# EAGLE design ink_driver (EAGLE 6.4)
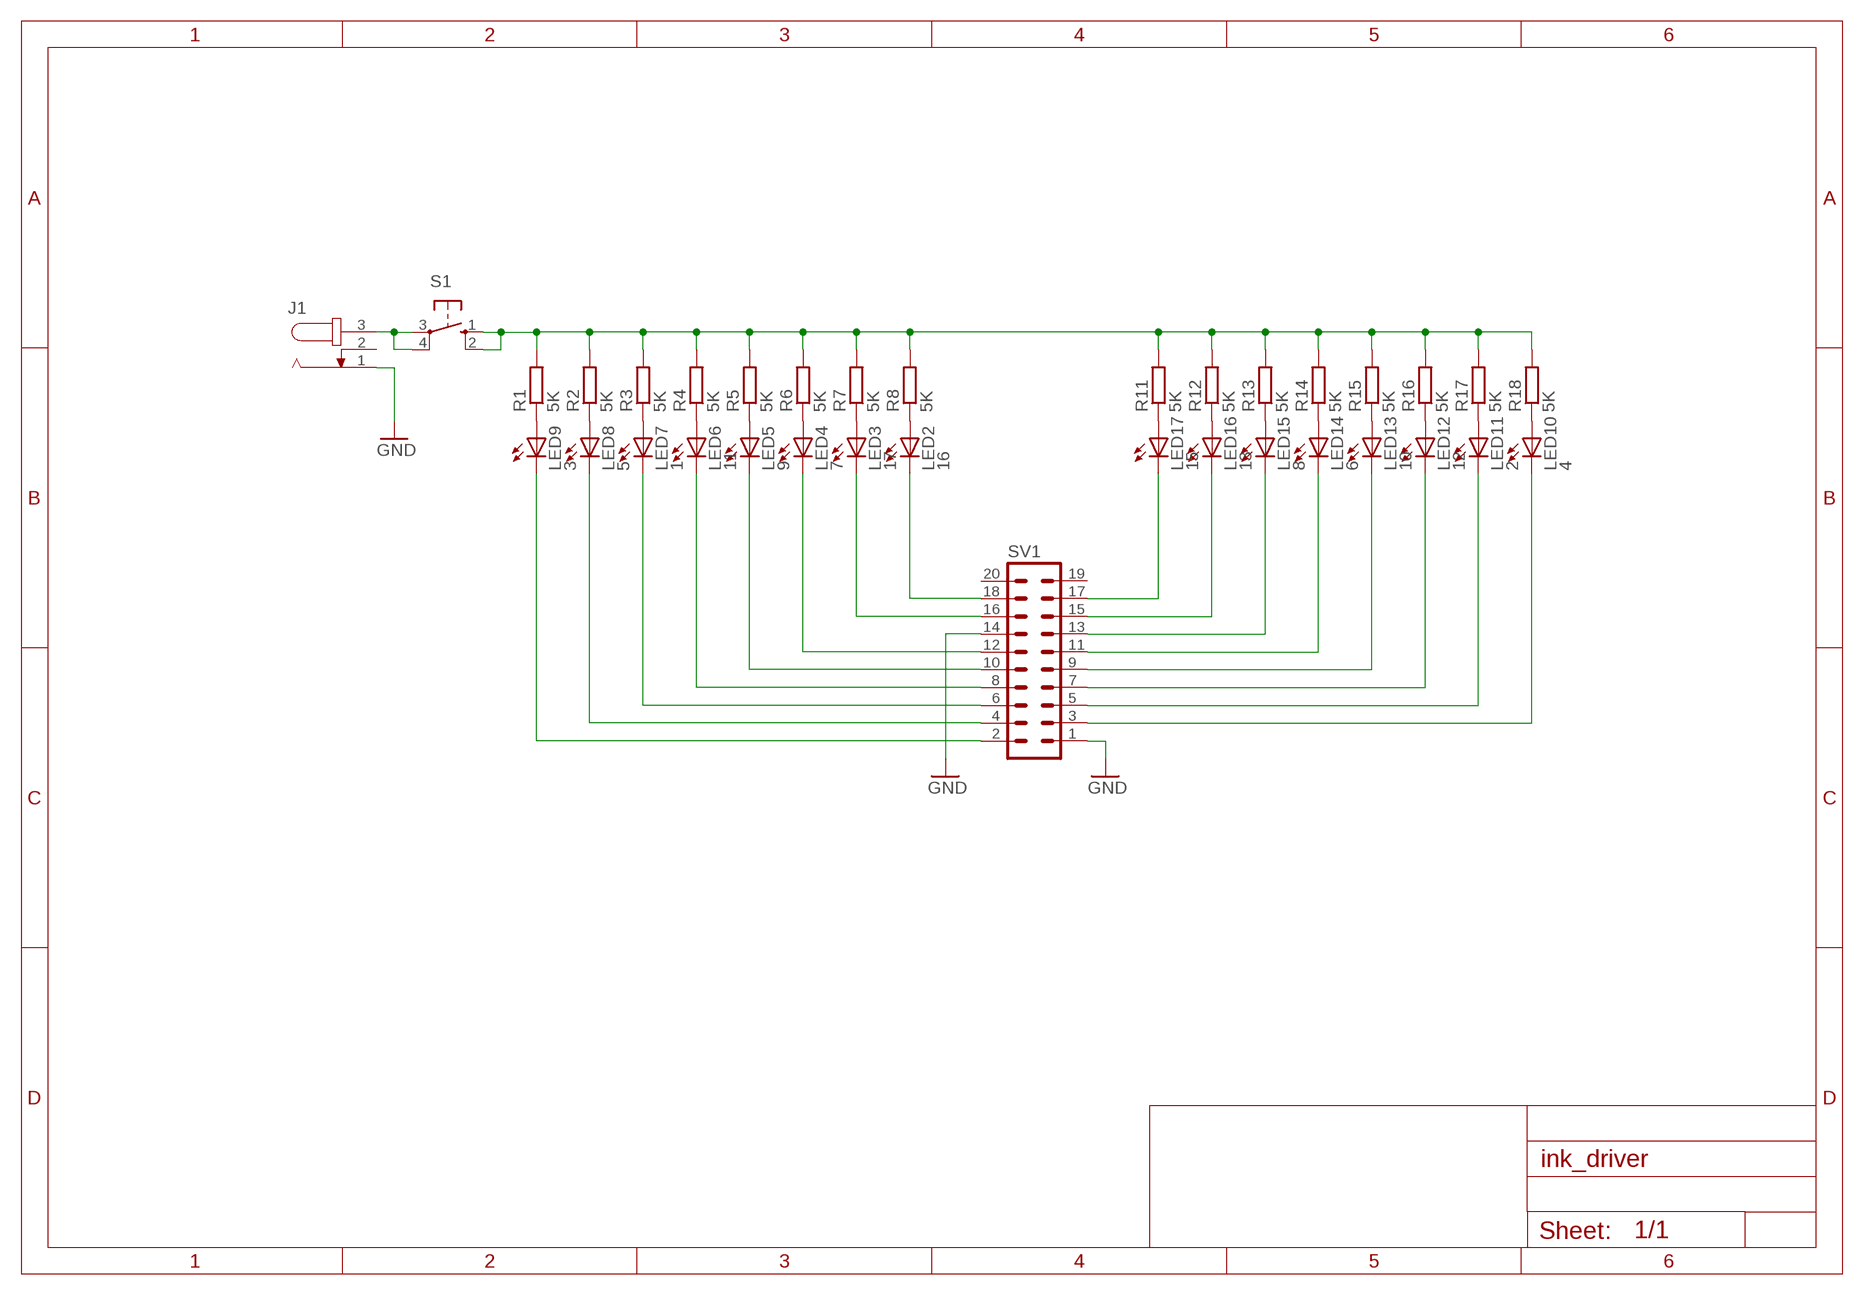
[diagram p0: schematic, sheet 1]

## Parts
J1  JACK-PLUG1  [SPC4078]
LED2  16  LED3MM  [LED3MM]
LED3  17  LED3MM  [LED3MM]
LED4  7  LED3MM  [LED3MM]
LED5  9  LED3MM  [LED3MM]
LED6  11  LED3MM  [LED3MM]
LED7  1  LED3MM  [LED3MM]
LED8  5  LED3MM  [LED3MM]
LED9  3  LED3MM  [LED3MM]
LED10  4  LED3MM  [LED3MM]
LED11  2  LED3MM  [LED3MM]
LED12  12  LED3MM  [LED3MM]
LED13  10  LED3MM  [LED3MM]
LED14  6  LED3MM  [LED3MM]
LED15  8  LED3MM  [LED3MM]
LED16  13  LED3MM  [LED3MM]
LED17  15  LED3MM  [LED3MM]
R1  5K  R-EU_0207/10  [0207/10]
R2  5K  R-EU_0207/10  [0207/10]
R3  5K  R-EU_0207/10  [0207/10]
R4  5K  R-EU_0207/10  [0207/10]
R5  5K  R-EU_0207/10  [0207/10]
R6  5K  R-EU_0207/10  [0207/10]
R7  5K  R-EU_0207/10  [0207/10]
R8  5K  R-EU_0207/10  [0207/10]
R11  5K  R-EU_0207/10  [0207/10]
R12  5K  R-EU_0207/10  [0207/10]
R13  5K  R-EU_0207/10  [0207/10]
R14  5K  R-EU_0207/10  [0207/10]
R15  5K  R-EU_0207/10  [0207/10]
R16  5K  R-EU_0207/10  [0207/10]
R17  5K  R-EU_0207/10  [0207/10]
R18  5K  R-EU_0207/10  [0207/10]
S1  10-XX  [B3F-10XX]
SV1  ML20  [ML20]

## Nets
GND: J1.1 SV1.1 SV1.14
N$2: LED2.K(C) SV1.18
N$3: LED3.K(C) SV1.16
N$4: LED4.K(C) SV1.12
N$5: LED5.K(C) SV1.10
N$6: LED6.K(C) SV1.8
N$7: LED7.K(C) SV1.6
N$8: LED8.K(C) SV1.4
N$9: LED9.K(C) SV1.2
N$10: LED9.A R1.1
N$11: LED8.A R2.1
N$12: LED7.A R3.1
N$13: LED6.A R4.1
N$14: LED5.A R5.1
N$15: LED4.A R6.1
N$16: LED3.A R7.1
N$17: LED2.A R8.1
N$20: LED17.A R11.1
N$21: LED16.A R12.1
N$22: LED15.A R13.1
N$23: LED14.A R14.1
N$24: LED13.A R15.1
N$25: LED12.A R16.1
N$26: LED11.A R17.1
N$27: LED10.A R18.1
N$29: LED17.K(C) SV1.17
N$30: LED16.K(C) SV1.15
N$31: LED15.K(C) SV1.13
N$32: LED14.K(C) SV1.11
N$33: LED13.K(C) SV1.9
N$34: LED12.K(C) SV1.7
N$35: LED11.K(C) SV1.5
N$36: LED10.K(C) SV1.3
N$37: R1.2 R2.2 R3.2 R4.2 R5.2 R6.2 R7.2 R8.2 R11.2 R12.2 R13.2 R14.2 R15.2 R16.2 R17.2 R18.2 S1.1(S) S1.2(S1)
N$38: J1.3 S1.3(P) S1.4(P1)
Unconnected: J1.2 SV1.19 SV1.20

## Library data of the parts
J1 = con-jack:JACK-PLUG: DC POWER JACK Power Jack, DC, Right Angle, Through Hole, Rated 5A at 16VDC, PC Terminals Distributor: Farnell (www.Farnell.de) Drawing: 84N1161.pdf / 84N1162.pdf Manufacturer: SPC Technology (www.spctechnology.com) Type: SPC4077 / SPC 4078
LED2-LED17 = led:LED: LED OSRAM: - CHIPLED LG R971, LG N971, LY N971, LG Q971, LY Q971, LO R971, LY R971 LH N974, LH R974 LS Q976, LO Q976, LY Q976 LO Q996 - Hyper CHIPLED LW Q18S LB Q993, LB Q99A, LB R99A - SideLED LS A670, LO A670, LY A670, LG A670, LP A670 LB A673, LV A673, LT A673, LW A673 LH A674 LY A675 LS A676, LA A676, LO A676, LY A676, LW A676 LS A679, LY A679, LG A679 - Hyper Micro SIDELED® LS Y876, LA Y876, LO Y876, LY Y876 LT Y87S - SmartLED LW L88C, LW L88S LB L89C, LB L89S, LG L890 LS L89K, LO L89K, LY L89K LS L896, LA L896, LO L896, LY L896 - TOPLED LS T670, LO T670, LY T670, LG T670, LP T670 LSG T670, LSP T670, LSY T670, LOP T670, LYG T670 LG T671, LOG T671, LSG T671 LB T673, LV T673, LT T673, LW T673 LH T674 LS T676, LA T676, LO T676, LY T676, LB T676, LH T676, LSB T676, LW T676 LB T67C, LV T67C, LT T67C, LS T67K, LO T67K, LY T67K, LW E67C LS E67B, LA E67B, LO E67B, LY E67B, LB E67C, LV E67C, LT E67C LW T67C LS T679, LY T679, LG T679 LS T770, LO T770, LY T770, LG T770, LP T770 LB T773, LV T773, LT T773, LW T773 LH T774 LS E675, LA E675, LY E675, LS T675 LS T776, LA T776, LO T776, LY T776, LB T776 LHGB T686 LT T68C, LB T68C - Hyper Mini TOPLED® LB M676 - Mini TOPLED Santana® LG M470 LS M47K, LO M47K, LY M47K Source: http://www.osram.convergy.de LUXEON: - LUMILED® LXK2-PW12-R00, LXK2-PW12-S00, LXK2-PW14-U00, LXK2-PW14-V00 LXK2-PM12-R00, LXK2-PM12-S00, LXK2-PM14-U00 LXK2-PE12-Q00, LXK2-PE12-R00, LXK2-PE12-S00, LXK2-PE14-T00, LXK2-PE14-U00 LXK2-PB12-K00, LXK2-PB12-L00, LXK2-PB12-M00, LXK2-PB14-N00, LXK2-PB14-P00, LXK2-PB14-Q00 LXK2-PR12-L00, LXK2-PR12-M00, LXK2-PR14-Q00, LXK2-PR14-R00 LXK2-PD12-Q00, LXK2-PD12-R00, LXK2-PD12-S00 LXK2-PH12-R00, LXK2-PH12-S00 LXK2-PL12-P00, LXK2-PL12-Q00, LXK2-PL12-R00 Source: www.luxeon.com KINGBRIGHT: KA-3528ASYC Source: www.kingbright.com
R1-R8 R11-R18 = rcl:R-EU_: RESISTOR, European symbol
S1 = switch-omron:10-XX: OMRON SWITCH
SV1 = con-harting-ml:ML20: HARTING

## Board
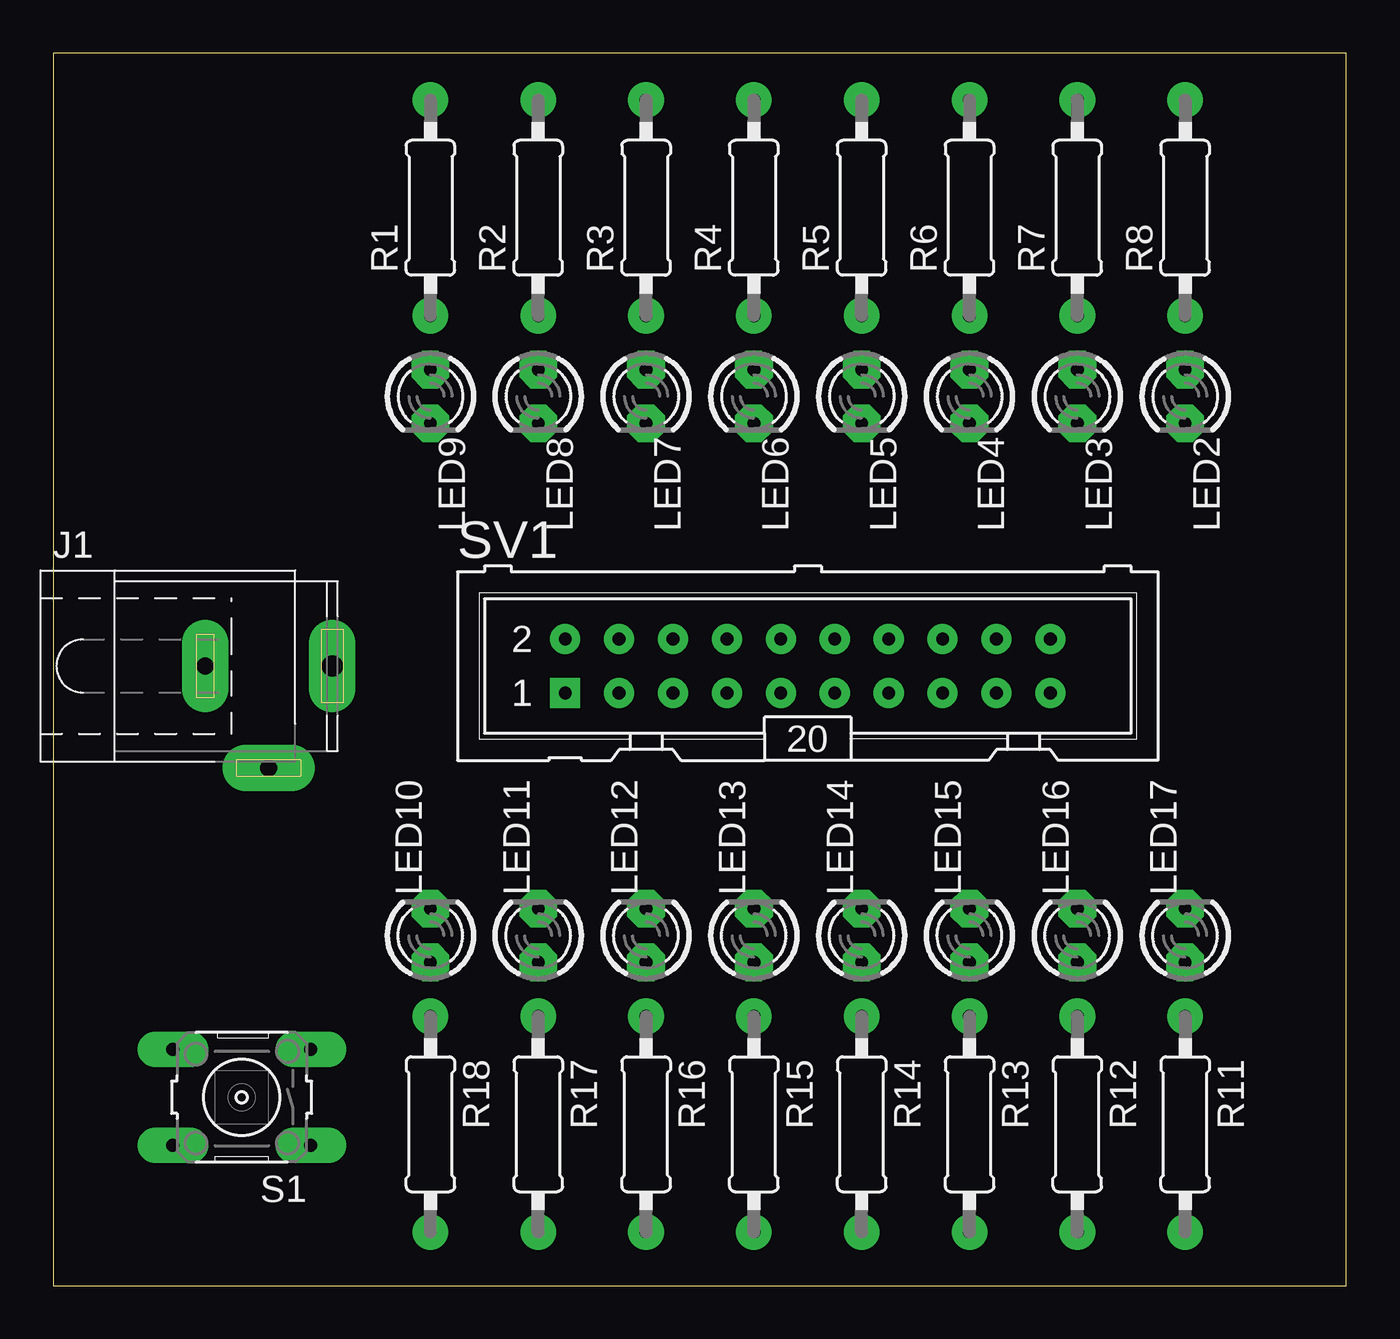
[diagram p1: board, top side]
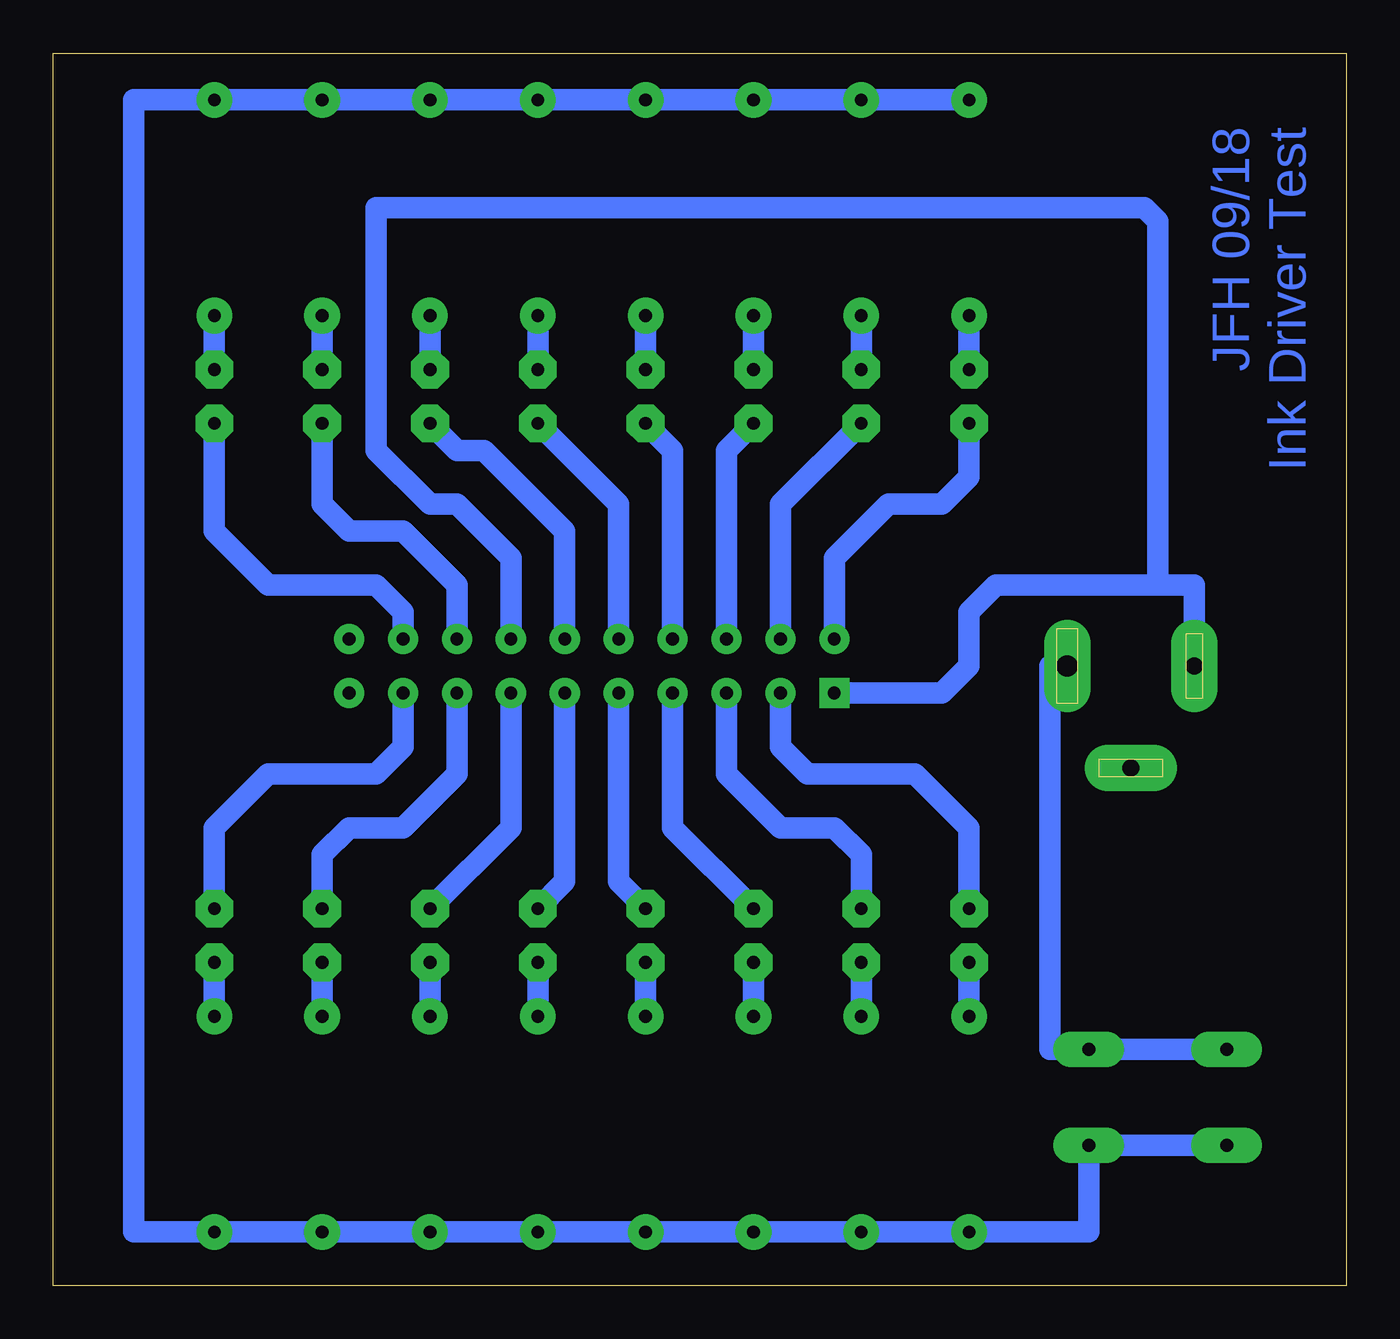
[diagram p2: board, bottom side, seen from below]

Size 60.94 x 58.09 mm. Coordinates in mm from the lower left corner, seen from the top.
Outline: 0,0 60.94,0 60.94,58.09 0,58.09 0,0
Copper layers (1*16): Top 0.035mm / dielectric 1.5mm / Bottom 0.035mm
Design rules "default": minimum track width 10mil, minimum drill 24mil, track to track 8mil, track to pad 8mil, pad to pad 8mil, via to via 8mil, smd to smd 8mil, copper to edge 40mil, drill to drill 8mil, minimum pad ring 10mil, minimum via ring 8mil, stop-mask expansion 4mil, vias tented up to drill 0mil, thermal gap 10mil

### Footprints (pad centres in the part's own frame; a part is rotated, then mirrored left to right if it is on the bottom)
SPC4078 = drill 0.8 pad 2.184 long: 1 -3,0; 2 0,-4.8 | drill 1 pad 2.184 long: 3 3,0
LED3MM = drill 0.6 pad 1.778 octagon: A -1.27,0; K 1.27,0
0207/10 = drill 0.6 pad 1.676: 1 -5.08,0; 2 5.08,0
B3F-10XX = drill 0.6 pad 1.676 long: 1 -3.251,2.261; 2 3.251,2.261; 3 -3.251,-2.261; 4 3.251,-2.261
ML20 = drill 0.6 pad 1.422 square: 1 -11.43,-1.27 | drill 0.6 pad 1.422: 2 -11.43,1.27; 3 -8.89,-1.27; 4 -8.89,1.27; 5 -6.35,-1.27; 6 -6.35,1.27; 7 -3.81,-1.27; 8 -3.81,1.27; 9 -1.27,-1.27; 10 -1.27,1.27; 11 1.27,-1.27; 12 1.27,1.27; 13 3.81,-1.27; 14 3.81,1.27; 15 6.35,-1.27; 16 6.35,1.27; 17 8.89,-1.27; 18 8.89,1.27; 19 11.43,-1.27; 20 11.43,1.27

### Placement (x,y rotation side)
J1  10.16,29.21 0 top
LED2  53.34,41.91 270 top
LED3  48.26,41.91 270 top
LED4  43.18,41.91 270 top
LED5  38.1,41.91 270 top
LED6  33.02,41.91 270 top
LED7  27.94,41.91 270 top
LED8  22.86,41.91 270 top
LED9  17.78,41.91 270 top
LED10  17.78,16.51 90 top
LED11  22.86,16.51 90 top
LED12  27.94,16.51 90 top
LED13  33.02,16.51 90 top
LED14  38.1,16.51 90 top
LED15  43.18,16.51 90 top
LED16  48.26,16.51 90 top
LED17  53.34,16.51 90 top
R1  17.78,50.8 90 top
R2  22.86,50.8 90 top
R3  27.94,50.8 90 top
R4  33.02,50.8 90 top
R5  38.1,50.8 90 top
R6  43.18,50.8 90 top
R7  48.26,50.8 90 top
R8  53.34,50.8 90 top
R11  53.34,7.62 270 top
R12  48.26,7.62 270 top
R13  43.18,7.62 270 top
R14  38.1,7.62 270 top
R15  33.02,7.62 270 top
R16  27.94,7.62 270 top
R17  22.86,7.62 270 top
R18  17.78,7.62 270 top
S1  8.89,8.89 180 top
SV1  35.56,29.21 0 top

### Tracks (layer width: path | path; a pad name or v marks a point on that pad's centre or on a via)
GND
  Bottom 1.016: SV1.14 39.37,34.29 41.91,36.83 43.18,36.83 45.72,39.37 45.72,50.8 9.53,50.8 8.89,50.17 8.89,33.02 | J1.1 7.16,33.02 8.89,33.02 | SV1.1 19.05,27.94 17.78,29.21 17.78,31.75 16.51,33.02 8.89,33.02
N$2
  Bottom 1.016: SV1.18 44.45,31.75 45.72,33.02 50.8,33.02 53.34,35.56 LED2.K
N$3
  Bottom 1.016: SV1.16 41.91,33.02 44.45,35.56 46.99,35.56 48.26,36.83 LED3.K
N$4
  Bottom 1.016: SV1.12 36.83,35.56 40.64,39.37 41.91,39.37 LED4.K
N$5
  Bottom 1.016: SV1.10 34.29,36.83 LED5.K
N$6
  Bottom 1.016: SV1.8 31.75,39.37 LED6.K
N$7
  Bottom 1.016: SV1.6 29.21,39.37 LED7.K
N$8
  Bottom 1.016: SV1.4 26.67,36.83 LED8.K
N$9
  Bottom 1.016: SV1.2 24.13,34.29 21.59,36.83 19.05,36.83 17.78,38.1 LED9.K
N$10
  Bottom 1.016: LED9.A R1.1
N$11
  Bottom 1.016: R2.1 LED8.A
N$12
  Bottom 1.016: LED7.A R3.1
N$13
  Bottom 1.016: R4.1 LED6.A
N$14
  Bottom 1.016: LED5.A R5.1
N$15
  Bottom 1.016: R6.1 LED4.A
N$16
  Bottom 1.016: LED3.A R7.1
N$17
  Bottom 1.016: R8.1 LED2.A
N$20
  Bottom 1.016: R11.1 LED17.A
N$21
  Bottom 1.016: LED16.A R12.1
N$22
  Bottom 1.016: R13.1 LED15.A
N$23
  Bottom 1.016: LED14.A R14.1
N$24
  Bottom 1.016: R15.1 LED13.A
N$25
  Bottom 1.016: LED12.A R16.1
N$26
  Bottom 1.016: R17.1 LED11.A
N$27
  Bottom 1.016: R18.1 LED10.A
N$29
  Bottom 1.016: SV1.17 44.45,25.4 45.72,24.13 50.8,24.13 53.34,21.59 LED17.K
N$30
  Bottom 1.016: SV1.15 41.91,24.13 44.45,21.59 46.99,21.59 48.26,20.32 LED16.K
N$31
  Bottom 1.016: SV1.13 39.37,21.59 LED15.K
N$32
  Bottom 1.016: SV1.11 36.83,19.05 LED14.K
N$33
  Bottom 1.016: SV1.9 34.29,19.05 LED13.K
N$34
  Bottom 1.016: SV1.7 31.75,21.59 LED12.K
N$35
  Bottom 1.016: SV1.5 29.21,24.13 26.67,21.59 24.13,21.59 22.86,20.32 LED11.K
N$36
  Bottom 1.016: SV1.3 26.67,25.4 25.4,24.13 20.32,24.13 17.78,21.59 LED10.K
N$37
  Bottom 1.016: S1.2 S1.1 12.14,2.54 R18.2 R17.2 R16.2 R15.2 R14.2 R13.2 R12.2 R11.2 57.15,2.54 57.15,55.88 R1.2 R2.2 R3.2 R4.2 R5.2 R6.2 R7.2 R8.2
N$38
  Bottom 1.016: S1.4 S1.3 13.97,11.15 13.97,29.21 J1.3

### Text on the board
Bottom: JFH 09/18 / Ink Driver Test